# Altium schematic sheet Stack Address Register.SchDoc
size C portrait; Author: E. Sims; Organization: Let's Build Rockets Inc.; SheetNumber: 3; SheetTotal: 4
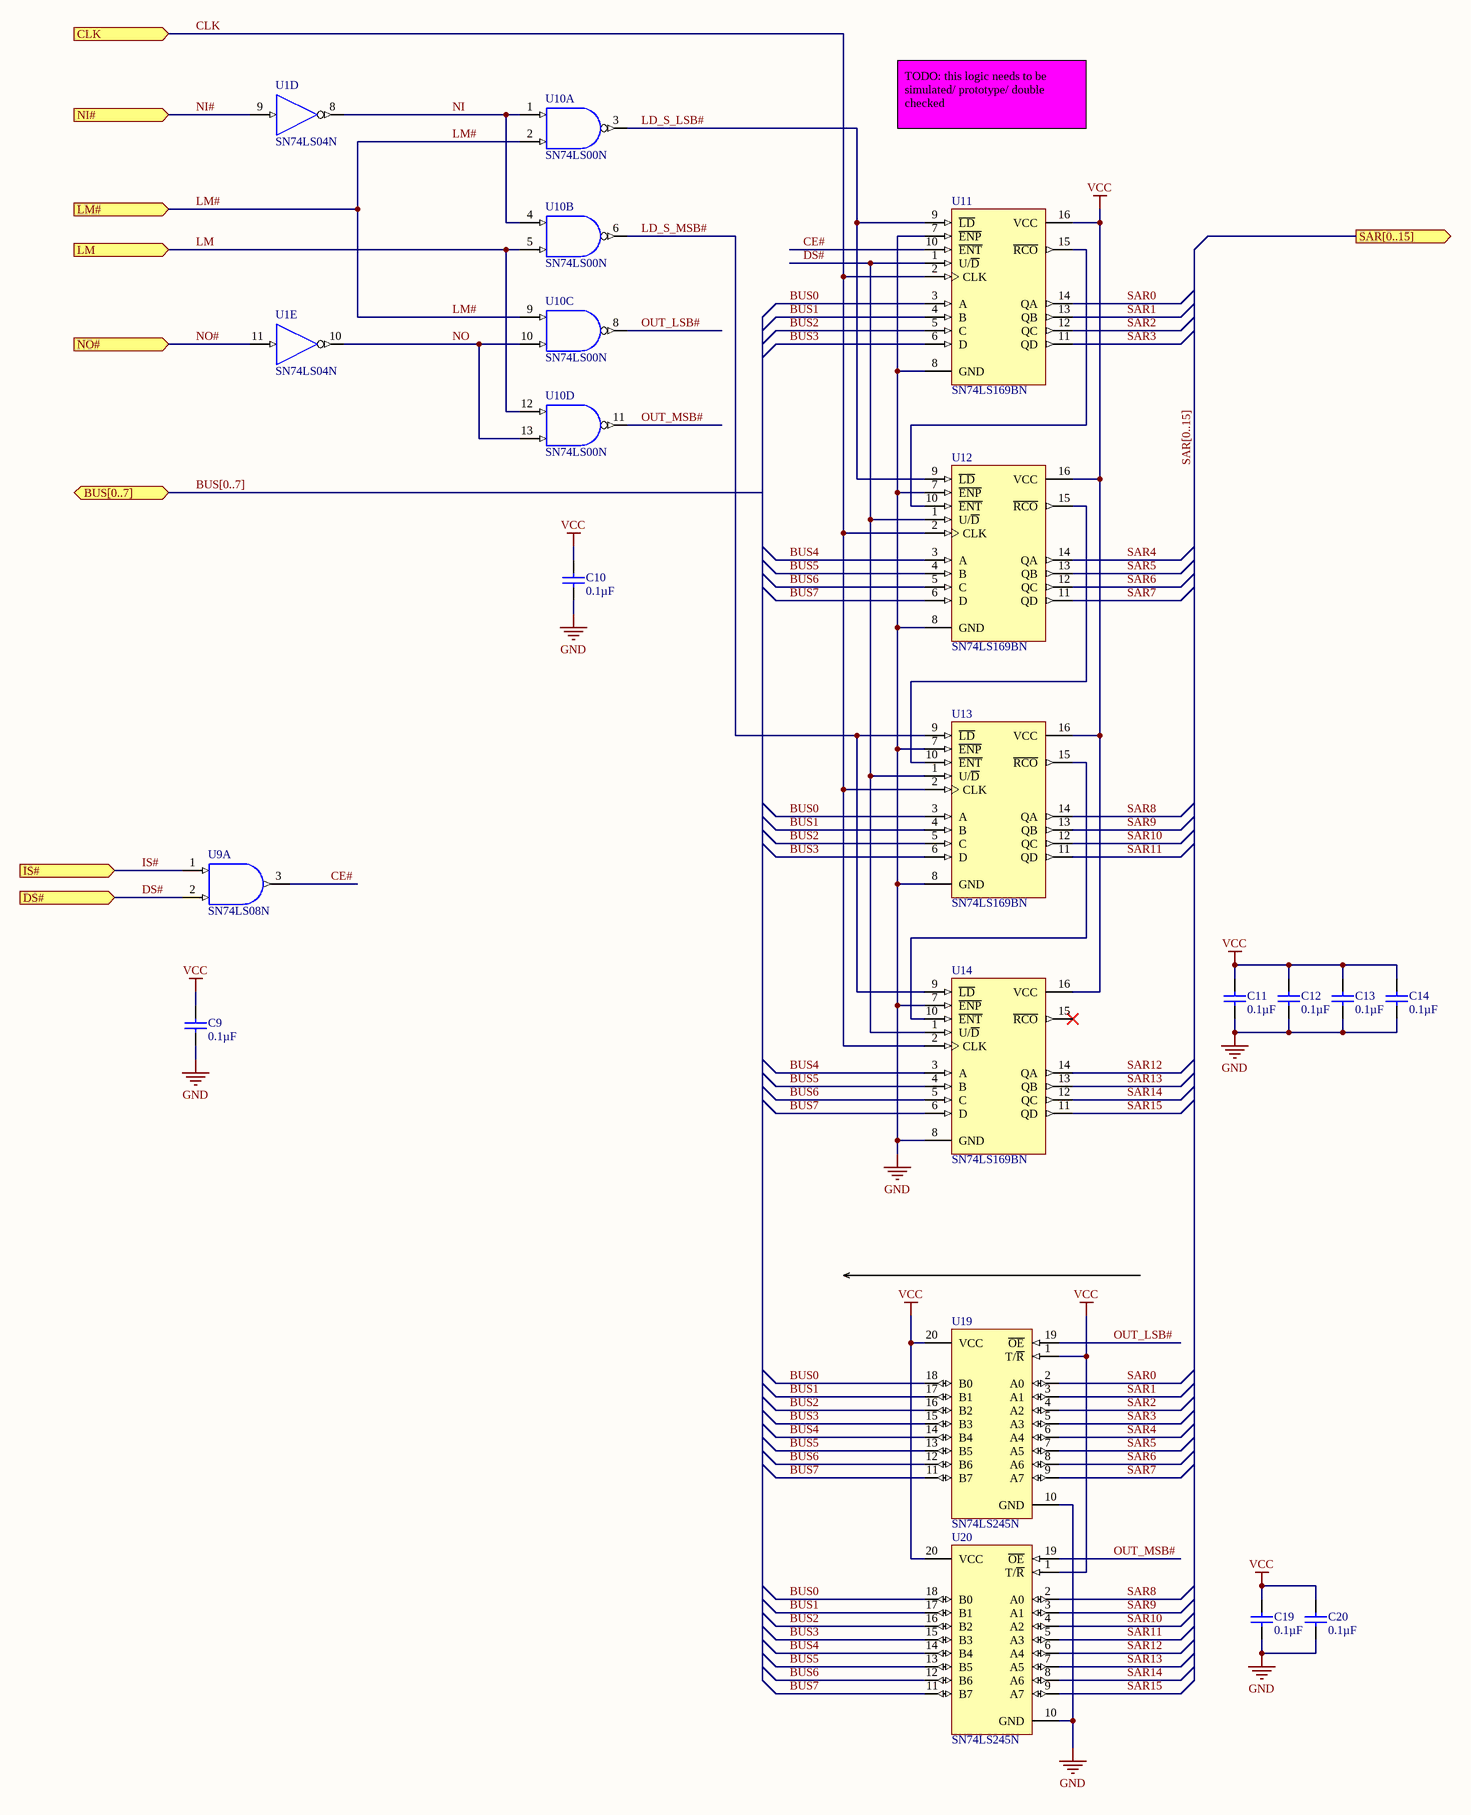
[diagram p0: Stack Address Register.SchDoc]

## Parts
C9  Capacitance: 0.1µF  [VISH-K104K15X7RF5TL2]  (hidden comment: K104K15X7RF5TL2)
C10  Capacitance: 0.1µF  [VISH-K104K15X7RF5TL2]  (hidden comment: K104K15X7RF5TL2)
C11  Capacitance: 0.1µF  [VISH-K104K15X7RF5TL2]  (hidden comment: K104K15X7RF5TL2)
C12  Capacitance: 0.1µF  [VISH-K104K15X7RF5TL2]  (hidden comment: K104K15X7RF5TL2)
C13  Capacitance: 0.1µF  [VISH-K104K15X7RF5TL2]  (hidden comment: K104K15X7RF5TL2)
C14  Capacitance: 0.1µF  [VISH-K104K15X7RF5TL2]  (hidden comment: K104K15X7RF5TL2)
C19  Capacitance: 0.1µF  [VISH-K104K15X7RF5TL2]  (hidden comment: K104K15X7RF5TL2)
C20  Capacitance: 0.1µF  [VISH-K104K15X7RF5TL2]  (hidden comment: K104K15X7RF5TL2)
U1  SN74LS04N  [N014]  (parts D,E of 6)
U9  SN74LS08N  [N014]  (part A of 4)
U10  SN74LS00N  [N014]  (parts A,B,C,D of 4)
U11  SN74LS169BN  [N016]
U12  SN74LS169BN  [N016]
U13  SN74LS169BN  [N016]
U14  SN74LS169BN  [N016]
U19  SN74LS245N  [N020]
U20  SN74LS245N  [N020]

## Ports
BUS[0..7] (bidir), CLK (in), DS# (in), IS# (in), LM (in), LM# (in), NI# (in), NO# (in), SAR[0..15] (out)

## Nets
GND: C9.2 C10.2 C11.2 C12.2 C13.2 C14.2 C19.2 C20.2 U1.7(GND) U9.7(GND) U10.7(GND) U11.7(~{ENP}) U11.8(GND) U12.7(~{ENP}) U12.8(GND) U13.7(~{ENP}) U13.8(GND) U14.7(~{ENP}) U14.8(GND) U19.10(GND) U20.10(GND)
VCC: C9.1 C10.1 C11.1 C12.1 C13.1 C14.1 C19.1 C20.1 U1.14(VCC) U9.14(VCC) U10.14(VCC) U11.16(VCC) U12.16(VCC) U13.16(VCC) U14.16(VCC) U19.1(T/~{R}) U19.20(VCC) U20.1(T/~{R}) U20.20(VCC)
BUS0: U11.3(A) U13.3(A) U19.18(B0) U20.18(B0)
BUS1: U11.4(B) U13.4(B) U19.17(B1) U20.17(B1)
BUS2: U11.5(C) U13.5(C) U19.16(B2) U20.16(B2)
BUS3: U11.6(D) U13.6(D) U19.15(B3) U20.15(B3)
BUS4: U12.3(A) U14.3(A) U19.14(B4) U20.14(B4)
BUS5: U12.4(B) U14.4(B) U19.13(B5) U20.13(B5)
BUS6: U12.5(C) U14.5(C) U19.12(B6) U20.12(B6)
BUS7: U12.6(D) U14.6(D) U19.11(B7) U20.11(B7)
CE#: U9.3(Y) U11.10(~{ENT})
CLK: U11.2(CLK) U12.2(CLK) U13.2(CLK) U14.2(CLK) ; port CLK
DS#: U9.2(B) U11.1(U/~{D}) U12.1(U/~{D}) U13.1(U/~{D}) U14.1(U/~{D}) ; port DS#
IS#: U9.1(A) ; port IS#
LD_S_LSB#: U10.3(Y) U11.9(~{LD}) U12.9(~{LD})
LD_S_MSB#: U10.6(Y) U13.9(~{LD}) U14.9(~{LD})
LM: U10.5(B) U10.12(A) ; port LM
LM#: U10.2(B) U10.9(A) ; port LM#
NI: U1.8(Y) U10.1(A) U10.4(A)
NI#: U1.9(A) ; port NI#
NO: U1.10(Y) U10.10(B) U10.13(B)
NO#: U1.11(A) ; port NO#
OUT_LSB#: U10.8(Y) U19.19(~{OE})
OUT_MSB#: U10.11(Y) U20.19(~{OE})
SAR0: U11.14(QA) U19.2(A0)
SAR1: U11.13(QB) U19.3(A1)
SAR2: U11.12(QC) U19.4(A2)
SAR3: U11.11(QD) U19.5(A3)
SAR4: U12.14(QA) U19.6(A4)
SAR5: U12.13(QB) U19.7(A5)
SAR6: U12.12(QC) U19.8(A6)
SAR7: U12.11(QD) U19.9(A7)
SAR8: U13.14(QA) U20.2(A0)
SAR9: U13.13(QB) U20.3(A1)
SAR10: U13.12(QC) U20.4(A2)
SAR11: U13.11(QD) U20.5(A3)
SAR12: U14.14(QA) U20.6(A4)
SAR13: U14.13(QB) U20.7(A5)
SAR14: U14.12(QC) U20.8(A6)
SAR15: U14.11(QD) U20.9(A7)
NetU11_15: U11.15(~{RCO}) U12.10(~{ENT})
NetU12_15: U12.15(~{RCO}) U13.10(~{ENT})
NetU13_15: U13.15(~{RCO}) U14.10(~{ENT})

Not connected (* = marked no-connect by the designer): U14 15(~{RCO})*

## Buses and harness runs
bus BUS[0..7] = port BUS[0..7]
bus SAR[0..15] = port SAR[0..15]

## Notes on the sheet
- TODO: this logic needs to be simulated/ prototype/ double checked
- Let's Build Rocket's Inc. Modular Paylaod System Based on TMP-010 Rev
  For more information visit https://github.com/LetsBuildRockets/Modular-Payload-System
  This work is licensed under CC BY-NC 4.0. To view a copy of this license, visit https://creativecommons.org/licenses/by-nc/4.0
- Title
- Size:
- Date:
- Assembly Variant:
- B
- Number:
- Time:
- Revision:
- Sheet
- of
- Author:
- File:

## Library data of the parts
C9-C14 C19 C20 = CMP-2000-06508-1: Ceramic Capacitor, 100 nF, +/- 10%, 50 V, -55 to 125 degC, 2-Pin THD, RoHS, Tape and Reel; Manufacturer: Vishay; Other Names: BC1084CT; Catalog Drawings: Mono-KapSide2-15_5.58Mono-KapSide1_15; Temperature Coefficient: X7R; Voltage - Rated: 50V; Online Catalog: Mono-Kap™Series; Size / Dimension: 0.157"Lx0.098"W(4.00mmx2.50mm); Operating Temperature: -55°C~125°C; Family: CeramicCapacitors; Manufacturer URL: http://www.vishay.com/; Standard Package: 1; Thickness (Max): -; Ratings: -; Datasheet Version: 08/2013; Package Description: 2-Pin Through Hole Device, Body 4 x 2.6 mm; Mounting Type: ThroughHole; Features: -; Lead Spacing: 0.098"(2.50mm); Tolerance: ±10%; Category: Capacitors; Mounting Technology: ThroughHole; Lead Style: Straight; Datasheet URL: http://www.vishay.com/docs/45171/kseries.pdf; Applications: GeneralPurpose; Package / Case: Radial; Height - Seated (Max): 0.220"(5.58mm); Package Reference: K104K15X7RF5TL2; Series: Mono-Kap™K; Packaging: CutTape(CT)
U1 = SN74LS04N: Hex Inverter; Published: 8-Jun-2000; LatestRevisionDate: 04-Mar-2005; LatestRevisionNote: Stylized 3D Model Added.; DatasheetVersion: Mar-1988; PackageVersion: Oct-1995; PackageReference: N014; Publisher: Altium Limited; PackageDescription: DIP; 14 Leads; Row Spacing 7.62 mm; Pitch 2.54 mm; ComponentLink1Description: Manufacturer Link; ComponentLink1URL: http://www.ti.com/; ComponentLink2Description: Datasheet; ComponentLink2URL: http://www-s.ti.com/sc/ds/sn74ls04.pdf
U9 = SN74LS08N: Quadruple 2-Input Positive-AND Gate; Published: 8-Jun-2000; LatestRevisionDate: 04-Mar-2005; LatestRevisionNote: Stylized 3D Model Added.; DatasheetVersion: Mar-1988; PackageVersion: Oct-1995; PackageReference: N014; Publisher: Altium Limited; PackageDescription: DIP; 14 Leads; Row Spacing 7.62 mm; Pitch 2.54 mm; ComponentLink1Description: Manufacturer Link; ComponentLink1URL: http://www.ti.com/; ComponentLink2Description: Datasheet; ComponentLink2URL: http://www-s.ti.com/sc/ds/SN74LS08.pdf
U10 = SN74LS00N: Quadruple 2-Input Positive-NAND Gate; Published: 8-Jun-2000; LatestRevisionDate: 04-Mar-2005; LatestRevisionNote: Stylized 3D Model Added.; DatasheetVersion: Mar-1988; PackageVersion: Oct-1995; PackageReference: N014; Publisher: Altium Limited; PackageDescription: DIP; 14 Leads; Row Spacing 7.62 mm; Pitch 2.54 mm; ComponentLink1Description: Manufacturer Link; ComponentLink1URL: http://www.ti.com/; ComponentLink2Description: Datasheet; ComponentLink2URL: http://www-s.ti.com/sc/ds/sn74ls00.pdf
U11-U14 = SN74LS169BN: Synchronous 4-Bit Up/Down Binary Counter; Published: 8-Jun-2000; LatestRevisionDate: 04-Mar-2005; LatestRevisionNote: Stylized 3D Model Added.; DatasheetVersion: Mar-1988; PackageVersion: Oct-1995; PackageReference: N016; Publisher: Altium Limited; PackageDescription: DIP; 16 Leads; Row Spacing 7.62 mm; Pitch 2.54 mm; Code_JEDEC: MS-001-BB; ComponentLink1Description: Manufacturer Link; ComponentLink1URL: http://www.ti.com/; ComponentLink2Description: Datasheet; ComponentLink2URL: http://www-s.ti.com/sc/ds/sn74ls169b.pdf
U19 U20 = SN74LS245N: Octal Bus Transceiver with 3-State Outputs; Published: 8-Jun-2000; LatestRevisionDate: 04-Mar-2005; LatestRevisionNote: Stylized 3D Model Added.; DatasheetVersion: Mar-1988; PackageVersion: Oct-1995; PackageReference: N020; Publisher: Altium Limited; PackageDescription: DIP; 20 Leads; Row Spacing 7.62 mm; Pitch 2.54 mm; ComponentLink1Description: Manufacturer Link; ComponentLink1URL: http://www.ti.com/; ComponentLink2Description: Datasheet; ComponentLink2URL: http://www-s.ti.com/sc/ds/sn74ls245.pdf